# Altium project VR Joypad.PrjPcb
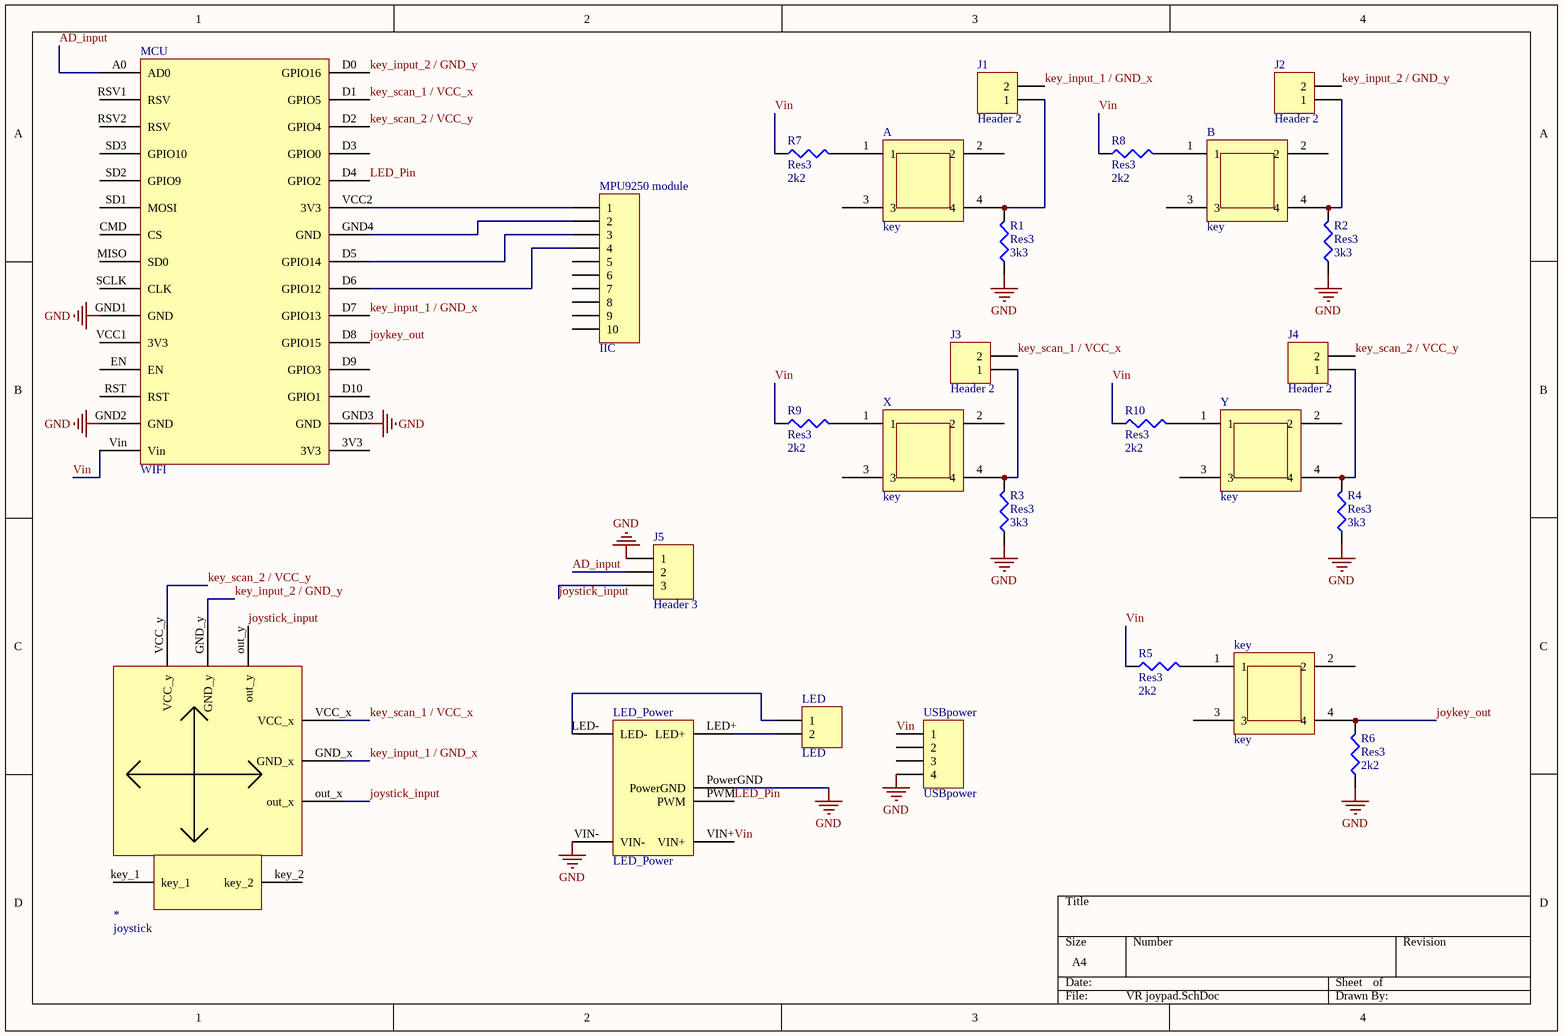
[diagram p0: VR joypad.SchDoc]
1 sheet, 26 parts. Net scope: global (net labels, ports and power ports of the same name join across sheets).
Board file: VR joypad.PcbDoc

## Sheet VR joypad.SchDoc
size A4; PageSetup: Record=PageOptions|CenterHorizontal=True|CenterVertical=True|PrintScale=-0.03|XCorrection=1.00|YCorrection=1.00|PrintKind=1|BorderSize=5000000|LeftOffset=0|BottomOffset=0|Orientation=2|PaperLength=1000|PaperWidth=1000|Scale=100|PaperSource=7|PrintQuality=600|MediaType=1|DitherType=10|PrintScaleMode=1|PaperKind=A4|PaperIndex=9

### Parts
*  joystick  [joystick]
A  key  [PCBComponent_1 - duplicate]
B  key  [PCBComponent_1 - duplicate]
J1  Header 2  [HDR1X2]
J2  Header 2  [HDR1X2]
J3  Header 2  [HDR1X2]
J4  Header 2  [HDR1X2]
J5  Header 3  [HDR1X3]
key  key  [PCBComponent_1 - duplicate]
LED  LED  [HDR1X2]
LED_Power  LED_Power  [PCBComponent_1 - duplicate1]
MCU  WIFI  [PCBComponent_1]
MPU9250_module  IIC  [HDR1X10]
R1  Res3  value 3k3  [6-0805_N]
R2  Res3  value 3k3  [6-0805_N]
R3  Res3  value 3k3  [6-0805_N]
R4  Res3  value 3k3  [6-0805_N]
R5  Res3  value 2k2  [6-0805_N]
R6  Res3  value 2k2  [6-0805_N]
R7  Res3  value 2k2  [6-0805_N]
R8  Res3  value 2k2  [6-0805_N]
R9  Res3  value 2k2  [6-0805_N]
R10  Res3  value 2k2  [6-0805_N]
USBpower  USBpower  [HDR1X4]
X  key  [PCBComponent_1 - duplicate]
Y  key  [PCBComponent_1 - duplicate]

### Nets
GND: J5.1 LED_Power.PowerGND LED_Power.VIN- MCU.GND1(GND) MCU.GND2(GND) MCU.GND3(GND) R1.1 R2.1 R3.1 R4.1 R6.1 USBpower.4
AD_input: J5.2 MCU.A0(AD0)
joykey_out: key.4 MCU.D8(GPIO15) R6.2
joystick_input: *.out_x *.out_y J5.3
key_input_1 / GND_x: *.GND_x J1.2 MCU.D7(GPIO13)
key_input_2 / GND_y: *.GND_y J2.2 MCU.D0(GPIO16)
key_scan_1 / VCC_x: *.VCC_x J3.2 MCU.D1(GPIO5)
key_scan_2 / VCC_y: *.VCC_y J4.2 MCU.D2(GPIO4)
LED_Pin: LED_Power.PWM MCU.D4(GPIO2)
Vin: LED_Power.VIN+ MCU.Vin R5.1 R7.1 R8.1 R9.1 R10.1 USBpower.1
NetA_1: A.1 R7.2
NetA_4: A.4 J1.1 R1.2
NetB_1: B.1 R8.2
NetB_4: B.4 J2.1 R2.2
NetJ3_1: J3.1 R3.2 X.4
NetJ4_1: J4.1 R4.2 Y.4
Netkey_1: key.1 R5.2
NetLED_1: LED.1 LED_Power.LED-
NetLED_2: LED.2 LED_Power.LED+
NetMCU_D5: MCU.D5(GPIO14) MPU9250_module.3
NetMCU_D6: MCU.D6(GPIO12) MPU9250_module.4
NetMCU_GND4: MCU.GND4(GND) MPU9250_module.2
NetMCU_VCC2: MCU.VCC2(3V3) MPU9250_module.1
NetR9_2: R9.2 X.1
NetR10_2: R10.2 Y.1

Not connected (* = marked no-connect by the designer): * key_1 key_2; A 2 3; B 2 3; key 2 3; MCU 3V3 CMD(CS) D3(GPIO0) D9(GPIO3) D10(GPIO1) EN MISO(SD0) RST RSV1(RSV) RSV2(RSV) SCLK(CLK) SD1(MOSI) SD2(GPIO9) SD3(GPIO10) VCC1(3V3); MPU9250_module 5 6 7 8 9 10; USBpower 2 3; X 2 3; Y 2 3

### Library data of the parts
J1-J4 LED = Header 2: Header, 2-Pin; LatestRevisionDate: 17-Jul-2002; LatestRevisionNote: Re-released for DXP Platform.; Publisher: Altium Limited
J5 = Header 3: Header, 3-Pin; LatestRevisionDate: 17-Jul-2002; LatestRevisionNote: Re-released for DXP Platform.; Publisher: Altium Limited
LED_Power = Power
MCU = Component_1
MPU9250_module = Header 10: Header, 10-Pin; LatestRevisionDate: 17-Jul-2002; LatestRevisionNote: Re-released for DXP Platform.; Publisher: Altium Limited
R1-R10 = Res3: Resistor; Published: 8-Jun-2000; LatestRevisionDate: 29-May-2009; LatestRevisionNote: IPC-7351 Footprint Added.; PackageReference: J1-0603; Publisher: Altium Limited; PackageDescription: Chip Resistor
USBpower = Header 4: Header, 4-Pin; LatestRevisionDate: 17-Jul-2002; LatestRevisionNote: Re-released for DXP Platform.; Publisher: Altium Limited